# Altium schematic sheet Periph.SchDoc
size A4; SheetNumber: 5; SheetTotal: 5
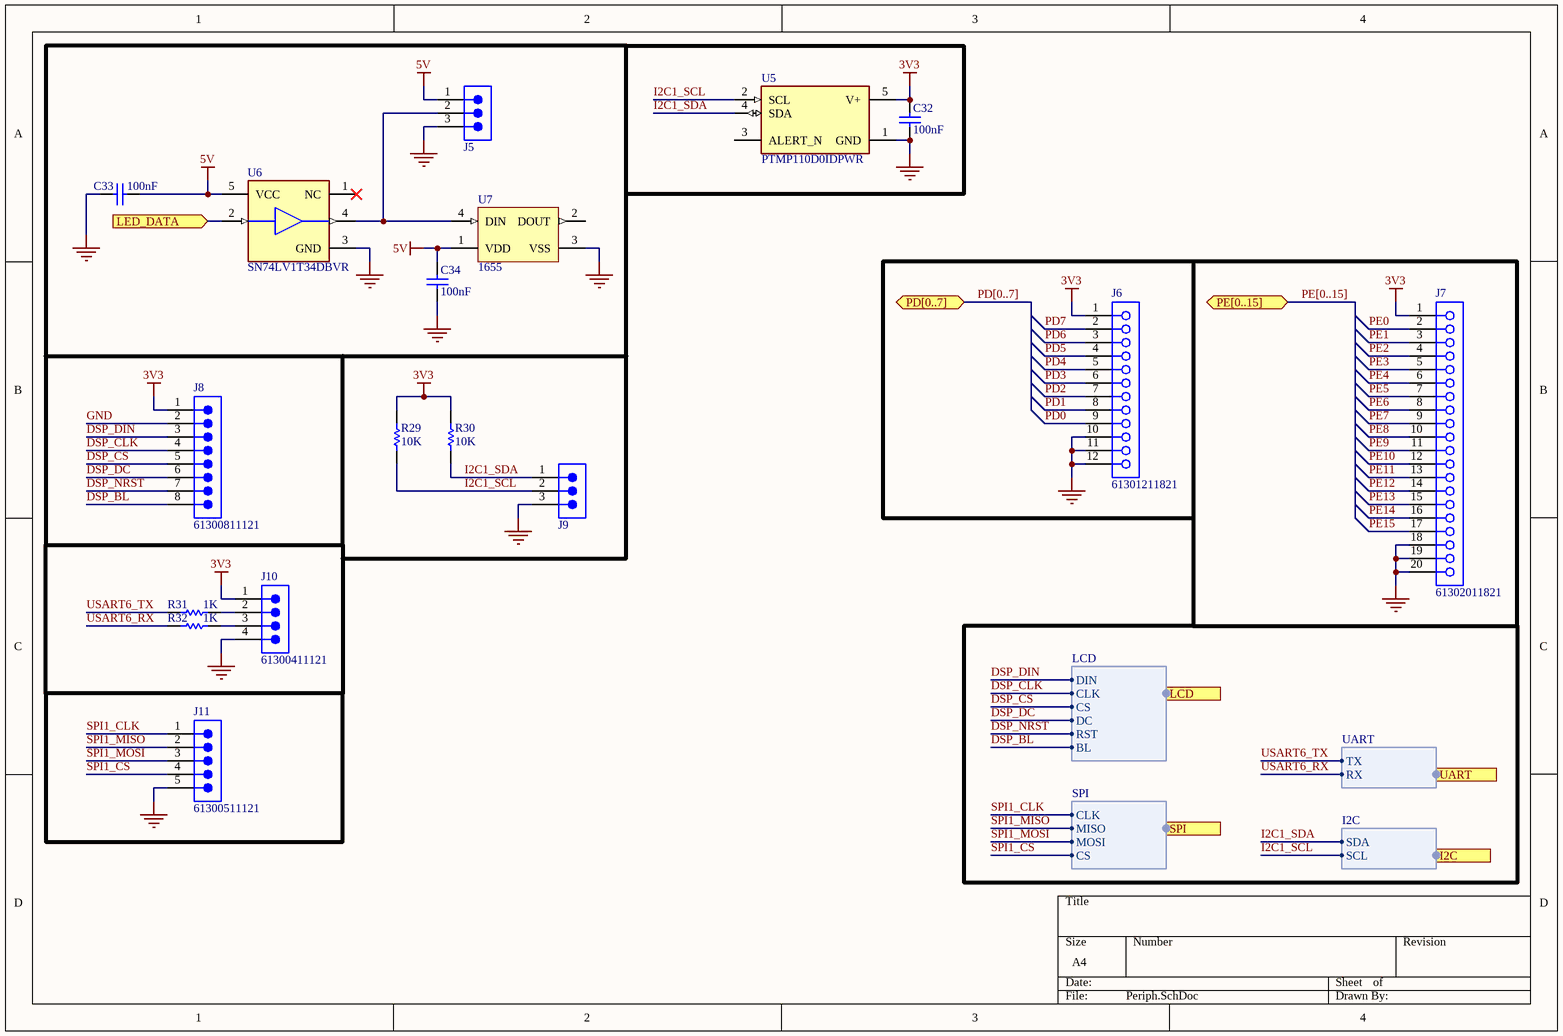
[diagram p0: Periph.SchDoc]

## Parts
C32  100nF  [0603]
C33  100nF  [0603]
C34  100nF  [0603]
J5  61300311121  [61300311121]  (value not drawn)
J6  61301211821  [61301211821]
J7  61302011821  [61302011821]
J8  61300811121  [61300811121]
J9  61300311121  [61300311121]  (value not drawn)
J10  61300411121  [61300411121]
J11  61300511121  [61300511121]
R29  10K  [0603]
R30  10K  [0603]
R31  1K  [0603]
R32  1K  [0603]
U5  PTMP110D0IDPWR  [DPW0005A-MFG]
U6  SN74LV1T34DBVR  [FP-DBV0005A-IPC_B]
U7  1655  [ADA-RGB-1655_V]

## Ports
I2C (harness I2c, see Main[2B], Controller[4C]), LCD (harness LCD, see Main[2B], Controller[3C]), LED_DATA (in, see Main[2A], Controller[1D]), PD[0..7] (bidir, see Main[2B], Controller[2B]), PE[0..15] (bidir, see Main[2B], Controller[1D]), SPI (harness SPI, see Main[2B], Controller[4C]), UART (harness UART, see Main[2B], Controller[4C])

## Harnesses
I2C: SDA, SCL
UART: TX, RX
SPI: CLK, MISO, MOSI, CS
LCD: DIN, CLK, CS, DC, RST, BL

## Nets
3V3: C32.1 J6.1 J7.1 J8.1 J10.1 R29.2 R30.2 U5.5(V+)
5V: C33.2 C34.1 J5.1 U6.5(VCC) U7.1(VDD)
GND: C32.2 C33.1 C34.2 J5.3 J6.10 J6.11 J6.12 J7.18 J7.19 J7.20 J8.2 J9.3 J10.4 J11.5 U5.1(GND) U6.3(GND) U7.3(VSS)
DSP_BL: J8.8 ; port LCD.BL
DSP_CLK: J8.4 ; port LCD.CLK
DSP_CS: J8.5 ; port LCD.CS
DSP_DC: J8.6 ; port LCD.DC
DSP_DIN: J8.3 ; port LCD.DIN
DSP_NRST: J8.7 ; port LCD.RST
I2C1_SCL: J9.2 R29.1 U5.2(SCL) ; port I2C.SCL
I2C1_SDA: J9.1 R30.1 U5.4(SDA) ; port I2C.SDA
LED_DATA: U6.2(A) ; port LED_DATA
PD0: J6.9
PD1: J6.8
PD2: J6.7
PD3: J6.6
PD4: J6.5
PD5: J6.4
PD6: J6.3
PD7: J6.2
PE0: J7.2
PE1: J7.3
PE2: J7.4
PE3: J7.5
PE4: J7.6
PE5: J7.7
PE6: J7.8
PE7: J7.9
PE8: J7.10
PE9: J7.11
PE10: J7.12
PE11: J7.13
PE12: J7.14
PE13: J7.15
PE14: J7.16
PE15: J7.17
SPI1_CLK: J11.1 ; port SPI.CLK
SPI1_CS: J11.4 ; port SPI.CS
SPI1_MISO: J11.2 ; port SPI.MISO
SPI1_MOSI: J11.3 ; port SPI.MOSI
USART6_RX: R32.1 ; port UART.RX
USART6_TX: R31.1 ; port UART.TX
NetJ5_2: J5.2 U6.4(Y) U7.4(DIN)
NetJ10_2: J10.2 R31.2
NetJ10_3: J10.3 R32.2

Not connected (* = marked no-connect by the designer): U5 3(ALERT_N); U6 1(NC)*; U7 2(DOUT)

## Buses and harness runs
bus PD[0..7] = port PD[0..7]
bus PE[0..15] = port PE[0..15]

## Library data of the parts
C32-C34 = C0603C104K1RACAUTO: Capacitor 100V / 0603; Value: 100n
J5 J9 = CMP-1502-01062-3: NexarPartId: 32855521; Current Rating: 3A; Voltage Rating: 250V; Number of Positions: 3; Pitch: 2.54mm; Contact Resistance: 20mΩ; Connector Type: Male Pin; Gender: Male; REACH SVHC: Unknown; Packaging: Bulk; Contact Material: Copper; Min Operating Temperature: -40°C; Number of Rows: 1; Orientation: Vertical; RoHS: Compliant; Contact Plating: Gold; Max Operating Temperature: 105°C; Mount: Through Hole; Height: 8.94mm; Operating Supply Voltage: 250V; Number of Pins: 3; Contact Mating Length: 5.9944mm; Number of Contacts: 3; Color: Black; Lead Free: Lead Free; Lead Pitch: 2.54mm; Termination: Solder
J6 = CMP-1502-01337-3: NexarPartId: 24514107; Operating Supply Voltage: 250V; Gender: Female; Current Rating: 3A; Contact Resistance: 20mΩ; Orientation: Vertical; Number of Pins: 12; RoHS: Non-Compliant; Lead Pitch: 2.54mm
J7 = CMP-1502-01348-3: NexarPartId: 61924744; Gender: Female; Current Rating: 3A; Operating Supply Voltage: 250V; Contact Resistance: 20mΩ; RoHS: Non-Compliant; Number of Pins: 20; Orientation: Vertical; Lead Pitch: 2.54mm
J8 = CMP-1502-01076-3: NexarPartId: 32855533; Connector Type: Male Pin; Number of Contacts: 8; Voltage Rating: 250V; Current Rating: 3A; Contact Resistance: 20mΩ; Pitch: 2.54mm; Gender: Male; Termination: Solder; Contact Material: Copper; Mount: Through Hole; Lead Pitch: 2.54mm; Number of Positions: 8; Operating Supply Voltage: 250V; Number of Pins: 8; Max Operating Temperature: 105°C; Height: 8.54mm; REACH SVHC: Unknown; Number of Rows: 1; Packaging: Bulk; Contact Plating: Gold; Contact Mating Length: 5.9944mm; Orientation: Vertical; RoHS: Compliant; Color: Black; Min Operating Temperature: -40°C
J10 = CMP-1502-01064-3: NexarPartId: 32855522; Operating Supply Voltage: 250V; Pitch: 2.54mm; Contact Resistance: 20mΩ; Number of Positions: 4; Current Rating: 3A; Connector Type: Male Pin; Gender: Male; Contact Plating: Gold; Height: 8.89mm; Lead Pitch: 2.54mm; Lead Free: Lead Free; Contact Mating Length: 5.9944mm; Number of Rows: 1; Termination: Solder; Packaging: Bulk; REACH SVHC: Unknown; Min Operating Temperature: -40°C; RoHS: Compliant; Number of Contacts: 4; Voltage Rating: 250V; Color: Black; Max Operating Temperature: 105°C; Contact Material: Copper; Mount: Through Hole; Orientation: Vertical; Number of Pins: 4
J11 = CMP-1502-01068-3: NexarPartId: 32855526; Connector Type: Male Pin; Gender: Male; Contact Resistance: 20mΩ; Pitch: 2.54mm; Operating Supply Voltage: 250V; Current Rating: 3A; Number of Contacts: 5; Lead Free: Lead Free; Color: Black; Packaging: Bulk; Lead Pitch: 2.54mm; Contact Material: Copper; Min Operating Temperature: -40°C; Contact Mating Length: 5.9944mm; Voltage Rating: 250V; Number of Pins: 5; Number of Positions: 5; Height: 8.89mm; Orientation: Vertical; REACH SVHC: Unknown; RoHS: Compliant; Contact Plating: Gold; Max Operating Temperature: 105°C; Mount: Through Hole; Number of Rows: 1; Termination: Solder
R29 R30 = CRCW060310K0FKEA: Resistor 0.1W; Value: 10K
R31 R32 = CRCW06031K00FKEA: Resistor 0.1W; Value: 1K
U5 = PTMP110D0IDPWR: No Description Available; Mfr_Name: Texas Instruments; TYPE: TYPE; RefDes: RefDes
U6 = CMP-0859-00123-4: IC BUF NON-INVERT 5.5V SOT23-5; Low Level Output Current: 8mA; Polarity: Non-Inverting; Number of Channels: 1; Propagation Delay: 15.5ns; High Level Output Current: -8mA; Quiescent Current: 1uA; Logic Function: Buffer; Min Supply Voltage: 1.6V; Min Operating Temperature: -40°C; Package Quantity: 3000; Max Operating Temperature: 125°C; Operating Supply Current: 8mA; Radiation Hardening: No; REACH SVHC: No SVHC; Number of Bits per Element: 1; Mount: Surface Mount; Number of Outputs: 1; Lead Free: Lead Free; Number of Pins: 5; Weight: 0.000353oz; Number of Output Lines: 1; Number of Elements: 1; Number of Input Lines: 1; Number of Bits: 1; Case/Package: SOT-23-5; Packaging: Tape and Reel; Max Supply Voltage: 5.5V; Number of Inputs: 1
U7 = CMP-2000-05026-1: Intelligent Control LED Integrated Light Source, 3.5 to 5.3 V, -25 to 80 degC, 4-Pin SMD, RoHS, Tape and Reel; Manufacturer: Adafruit-Industries-LLC; Number of LEDs: 10; Configuration: Discrete; Utilized LED: WS2812(5050); Datasheet URL: http://datasheet.octopart.com/ADA1655-Adafruit-Industries-datasheet-32028139.pdf; Series: Neopixel; Interface: -; Package Description: 4-Pin Surface Mount Device, Body 5 x 5 mm; Color: Red,Green,Blue(RGB); Category: Optoelectronics; Controller Type: -; Package Reference: 1655; Manufacturer URL: https://www.adafruit.com/; Mounting Type: SurfaceMount; Datasheet Version: May-13; Size / Dimension: 5.00mmLx5.00mmW; Family: Addressable,Specialty